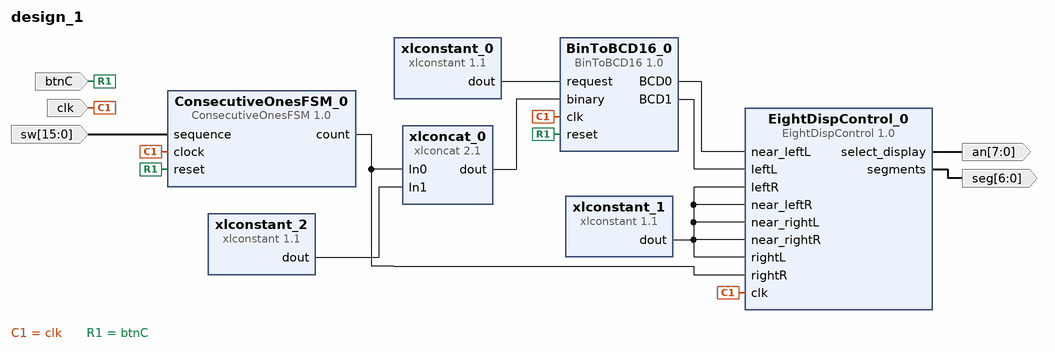
[diagram p0: block diagram of the top level]
# Vivado block design design_1, xc7a100tcsg324-3, Vivado 2016.4
create_bd_design design_1

create_bd_port -dir I clk
create_bd_port -dir I btnC
create_bd_port -dir O -from 6 -to 0 seg
create_bd_port -dir O -from 7 -to 0 an
create_bd_port -dir I -from 15 -to 0 sw

create_bd_cell -type ip -vlnv ua.pt:user:EightDispControl:1.0 EightDispControl_0
create_bd_cell -type ip -vlnv xilinx.com:ip:xlconstant:1.1 xlconstant_0
create_bd_cell -type ip -vlnv xilinx.com:ip:xlconstant:1.1 xlconstant_1
set_property -dict {CONFIG.CONST_WIDTH 4 CONFIG.CONST_VAL 0} [get_bd_cells xlconstant_1]
create_bd_cell -type ip -vlnv xilinx.com:user:ConsecutiveOnesFSM:1.0 ConsecutiveOnesFSM_0
set_property -dict {CONFIG.times 16} [get_bd_cells ConsecutiveOnesFSM_0]
create_bd_cell -type ip -vlnv ua.pt:user:BinToBCD16:1.0 BinToBCD16_0
create_bd_cell -type ip -vlnv xilinx.com:ip:xlconcat:2.1 xlconcat_0
set_property -dict {CONFIG.IN0_WIDTH 4 CONFIG.IN1_WIDTH 12} [get_bd_cells xlconcat_0]
create_bd_cell -type ip -vlnv xilinx.com:ip:xlconstant:1.1 xlconstant_2
set_property -dict {CONFIG.CONST_WIDTH 12 CONFIG.CONST_VAL 0} [get_bd_cells xlconstant_2]

# ---- connections ----

connect_bd_net [get_bd_ports clk] [get_bd_pins EightDispControl_0/clk] [get_bd_pins ConsecutiveOnesFSM_0/clock] [get_bd_pins BinToBCD16_0/clk]
connect_bd_net [get_bd_ports btnC] [get_bd_pins ConsecutiveOnesFSM_0/reset] [get_bd_pins BinToBCD16_0/reset]
connect_bd_net [get_bd_pins EightDispControl_0/segments] [get_bd_ports seg]
connect_bd_net [get_bd_pins EightDispControl_0/select_display] [get_bd_ports an]
connect_bd_net [get_bd_ports sw] [get_bd_pins ConsecutiveOnesFSM_0/sequence]
connect_bd_net [get_bd_pins BinToBCD16_0/BCD0] [get_bd_pins EightDispControl_0/near_leftL]
connect_bd_net [get_bd_pins BinToBCD16_0/BCD1] [get_bd_pins EightDispControl_0/leftL]
connect_bd_net [get_bd_pins xlconstant_1/dout] \
  [get_bd_pins EightDispControl_0/near_rightR] [get_bd_pins EightDispControl_0/near_leftR] \
  [get_bd_pins EightDispControl_0/leftR] [get_bd_pins EightDispControl_0/rightL] [get_bd_pins EightDispControl_0/near_rightL]
connect_bd_net [get_bd_pins xlconstant_0/dout] [get_bd_pins BinToBCD16_0/request]
connect_bd_net [get_bd_pins ConsecutiveOnesFSM_0/count] [get_bd_pins EightDispControl_0/rightR] [get_bd_pins xlconcat_0/In0]
connect_bd_net [get_bd_pins xlconcat_0/dout] [get_bd_pins BinToBCD16_0/binary]
connect_bd_net [get_bd_pins xlconstant_2/dout] [get_bd_pins xlconcat_0/In1]

validate_bd_design
save_bd_design
